# Altium schematic sheet 最小系统.SchDoc
size A4
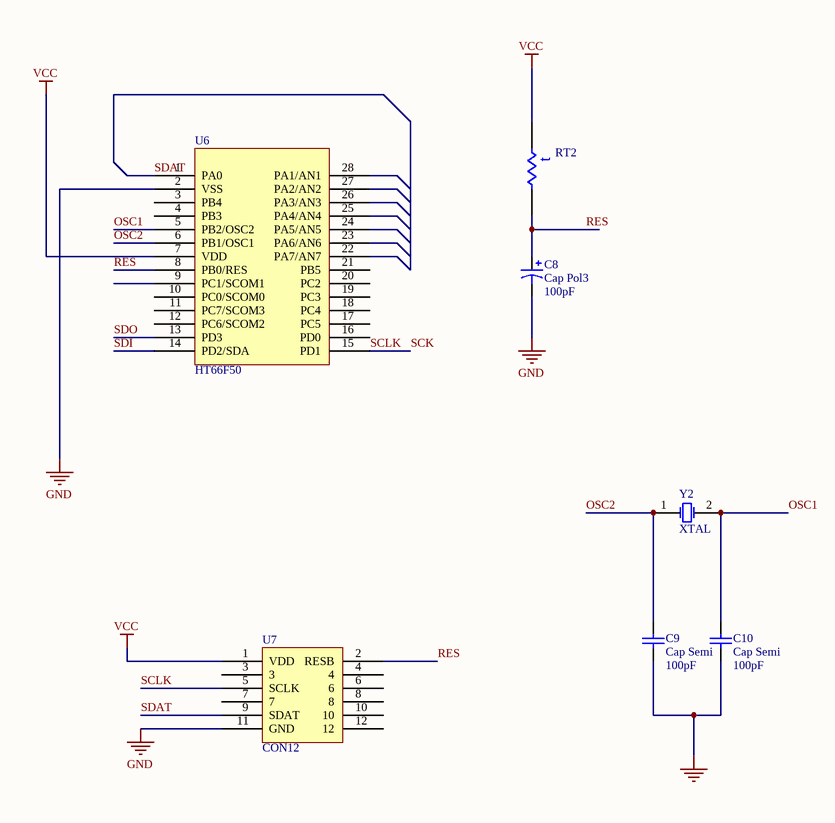
[diagram p0: 最小系统.SchDoc]

## Parts
C8  Cap Pol3  value 100pF  [C0805]
C9  Cap Semi  value 100pF  [1608[0603]]
C10  Cap Semi  value 100pF  [1608[0603]]
RT2  (no value)  [6-0805]
U6  HT66F50  [DIP28]
U7  CON12  [MHDR2X6]
Y2  XTAL  [R38]

## Nets
GND: C8.2 C9.2 C10.2 U6.2(VSS) U7.11(GND)
VCC: RT2.1 U6.7(VDD) U7.1(VDD)
OSC1: C10.1 U6.5(PB2/OSC2) Y2.2(OSC2)
OSC2: C9.1 U6.6(PB1/OSC1) Y2.1(OSC1)
RES: C8.1 RT2.2 U6.8(PB0/RES) U7.2(RESB)
SCK: U6.15(PD1) U7.5(SCLK)  [also labelled SCLK]
SDAT: U6.1(PA0) U7.9(SDAT)
SDI: U6.14(PD2/SDA)
SDO: U6.13(PD3)

Not connected (* = marked no-connect by the designer): U6 3(PB4) 4(PB3) 9(PC1/SCOM1) 10(PC0/SCOM0) 11(PC7/SCOM3) 12(PC6/SCOM2) 16(PD0) 17(PC5) 18(PC4) 19(PC3) 20(PC2) 21(PB5) 22(PA7/AN7) 23(PA6/AN6) 24(PA5/AN5) 25(PA4/AN4) 26(PA3/AN3) 27(PA2/AN2) 28(PA1/AN1); U7 3 4 6 7 8 10 12

## Notes on the sheet
- (in symbol Res Thermal) t

## Library data of the parts
C8 = Cap Pol3: Polarized Capacitor (Surface Mount); Published: 8-Jun-2000; LatestRevisionDate: 17-Jul-2002; LatestRevisionNote: Re-released for DXP Platform.; PackageReference: C0805; Publisher: Altium Limited
C9 C10 = Cap Semi: Capacitor (Semiconductor SIM Model); Published: 8-Jun-2000; LatestRevisionDate: 17-Jul-2002; LatestRevisionNote: Re-released for DXP Platform.; PackageReference: C1206; Publisher: Altium Limited
RT2 = Res Thermal: Thermistor; Published: 24-Mar-1999; LatestRevisionDate: 04-Mar-2005; LatestRevisionNote: PCB Footprint replaced.; PackageReference: 6-0805; Publisher: Altium Limited
Y2 = XTAL: Crystal Oscillator; Published: 8-Jun-2000; LatestRevisionDate: 17-Jul-2002; LatestRevisionNote: Re-released for DXP Platform.; PackageReference: R38; Publisher: Altium Limited